# EAGLE design matrixdriver_rev1a (EAGLE 4.16)
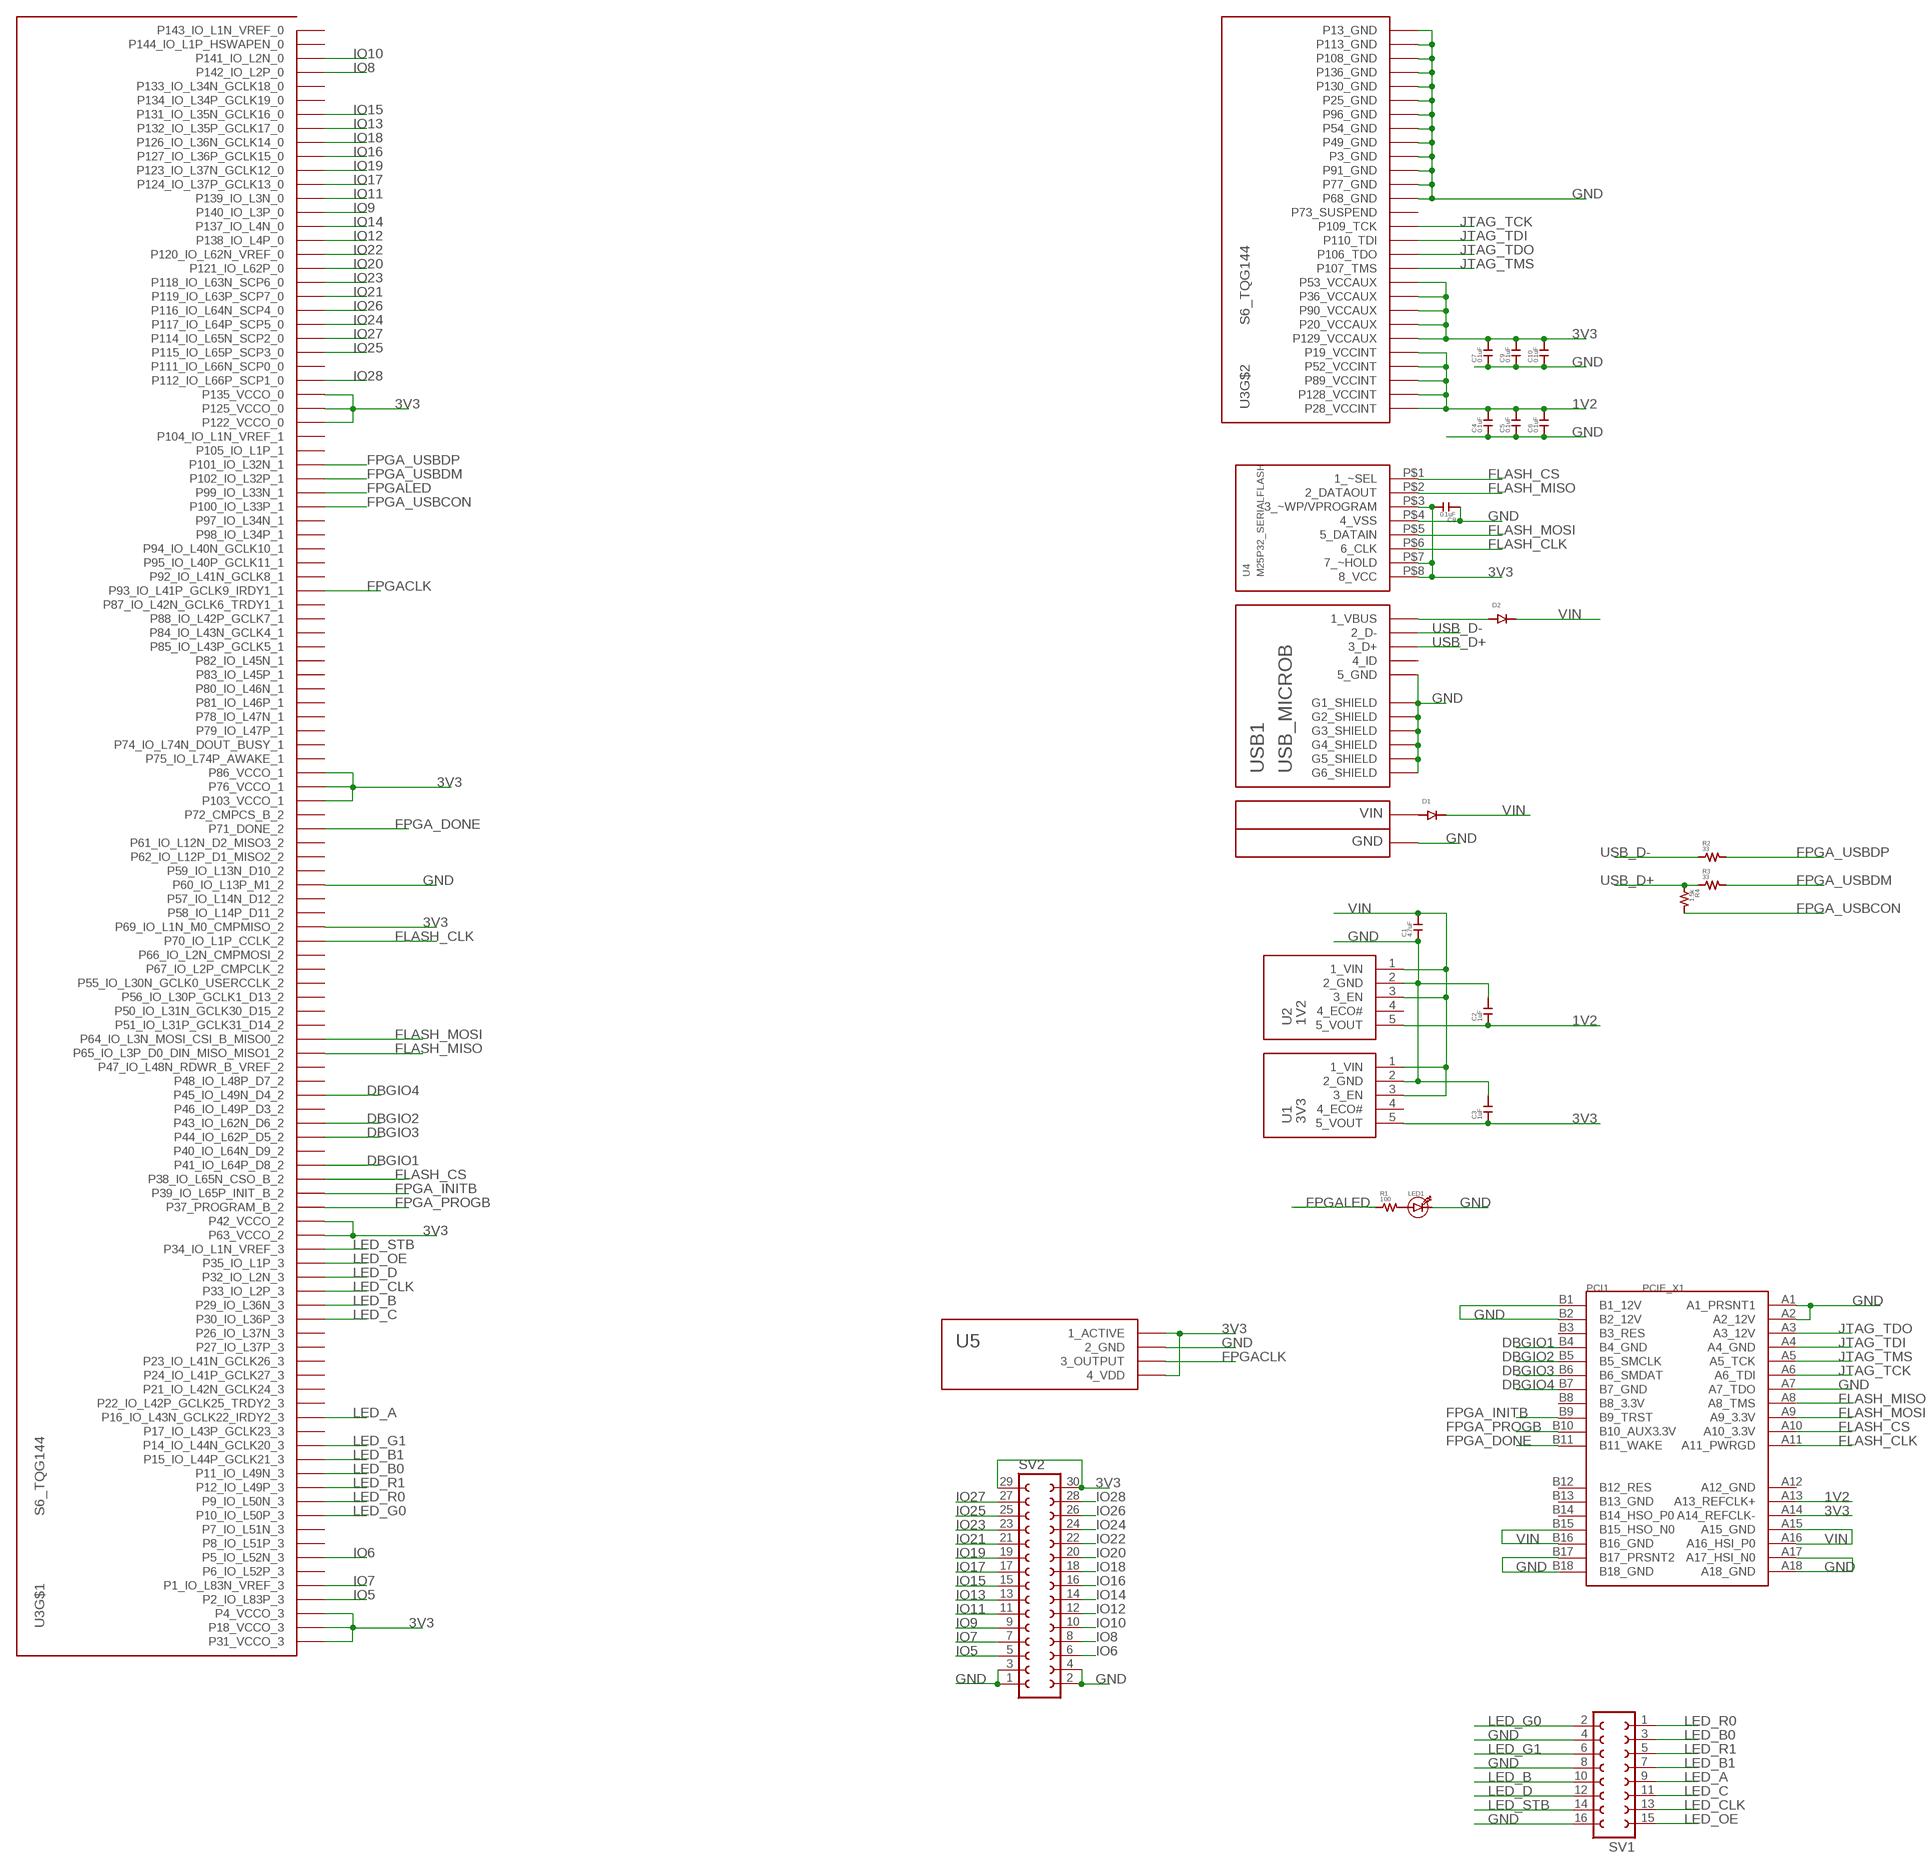
[diagram p0: schematic, sheet 1]

## Parts
C1  4.7uF  CAP0603  [0603]
C2  1uF  CAP0603  [0603]
C3  1uF  CAP0603  [0603]
C4  0.1uF  CAP0603  [0603]
C5  0.1uF  CAP0603  [0603]
C6  0.1uF  CAP0603  [0603]
C7  0.1uF  CAP0603  [0603]
C8  0.1uF  CAP0603  [0603]
C9  0.1uF  CAP0603  [0603]
C10  0.1uF  CAP0603  [0603]
D1  DIODE0603  [0603_DIODE]
D2  DIODE0603  [0603_DIODE]
GND  PIN1.2MM  [PIN_1.2MM]
LED1  LED0603  [0603_DIODE]
PCI1  PCIE_X1  [PCIE_X1]
R1  100  RES0603  [0603]
R2  33  RES0603  [0603]
R3  33  RES0603  [0603]
R4  1.5k  RES0603  [0603]
SV1  FE08-2  [FE08-2]
SV2  FE15-2  [FE15-2]
U1  3V3  VREG_LDO  [SOT-23-5]
U2  1V2  VREG_LDO  [SOT-23-5]
U3  S6_TQG144  [QFP144_.5MM_22X22]
U4  M25P32_SERIALFLASH  [SOIC-8-5.3MM]
U5  OSCASDMB  [ASDMB_2X2.5]
USB1  USB_MICROB  [USB_MICROB_FEMALE_FCI_10103594]
VIN  PIN1.2MM  [PIN_1.2MM]

## Nets
1V2: C2.1 C4.2 C5.2 C6.2 PCI1.A13(A13_REFCLK+) U2.5(5_VOUT) U3.P$19(P19_VCCINT) U3.P$28(P28_VCCINT) U3.P$52(P52_VCCINT) U3.P$89(P89_VCCINT) U3.P$128(P128_VCCINT)
3V3: C3.1 C7.2 C8.2 C9.2 C10.2 PCI1.A14(A14_REFCLK-) SV2.29 SV2.30 U1.5(5_VOUT) U3.P$4(P4_VCCO_3) U3.P$18(P18_VCCO_3) U3.P$20(P20_VCCAUX) U3.P$31(P31_VCCO_3) U3.P$36(P36_VCCAUX) U3.P$42(P42_VCCO_2) U3.P$53(P53_VCCAUX) U3.P$63(P63_VCCO_2) U3.P$69(P69_IO_L1N_M0_CMPMISO_2) U3.P$76(P76_VCCO_1) U3.P$86(P86_VCCO_1) U3.P$90(P90_VCCAUX) U3.P$103(P103_VCCO_1) U3.P$122(P122_VCCO_0) U3.P$125(P125_VCCO_0) U3.P$129(P129_VCCAUX) U3.P$135(P135_VCCO_0) U4.P$3(3_~WP/VPROGRAM) U4.P$7(7_~HOLD) U4.P$8(8_VCC) U5.1(1_ACTIVE) U5.4(4_VDD)
DBGIO1: PCI1.B4(B4_GND) U3.P$41(P41_IO_L64P_D8_2)
DBGIO2: PCI1.B5(B5_SMCLK) U3.P$43(P43_IO_L62N_D6_2)
DBGIO3: PCI1.B6(B6_SMDAT) U3.P$44(P44_IO_L62P_D5_2)
DBGIO4: PCI1.B7(B7_GND) U3.P$45(P45_IO_L49N_D4_2)
FLASH_CLK: PCI1.A11(A11_PWRGD) U3.P$70(P70_IO_L1P_CCLK_2) U4.P$6(6_CLK)
FLASH_CS: PCI1.A10(A10_3.3V) U3.P$38(P38_IO_L65N_CSO_B_2) U4.P$1(1_~SEL)
FLASH_MISO: PCI1.A8(A8_TMS) U3.P$65(P65_IO_L3P_D0_DIN_MISO_MISO1_2) U4.P$2(2_DATAOUT)
FLASH_MOSI: PCI1.A9(A9_3.3V) U3.P$64(P64_IO_L3N_MOSI_CSI_B_MISO0_2) U4.P$5(5_DATAIN)
FPGA_DONE: PCI1.B11(B11_WAKE) U3.P$71(P71_DONE_2)
FPGA_INITB: PCI1.B9(B9_TRST) U3.P$39(P39_IO_L65P_INIT_B_2)
FPGA_PROGB: PCI1.B10(B10_AUX3.3V) U3.P$37(P37_PROGRAM_B_2)
FPGA_USBCON: R4.2 U3.P$100(P100_IO_L33P_1)
FPGA_USBDM: R3.2 U3.P$102(P102_IO_L32P_1)
FPGA_USBDP: R2.2 U3.P$101(P101_IO_L32N_1)
FPGACLK: U3.P$93(P93_IO_L41P_GCLK9_IRDY1_1) U5.3(3_OUTPUT)
FPGALED: R1.1 U3.P$99(P99_IO_L33N_1)
GND: C1.1 C2.2 C3.2 C4.1 C5.1 C6.1 C7.1 C8.1 C9.1 C10.1 GND.P$1 LED1.- PCI1.A1(A1_PRSNT1) PCI1.A2(A2_12V) PCI1.A7(A7_TDO) PCI1.A17(A17_HSI_N0) PCI1.A18(A18_GND) PCI1.B1(B1_12V) PCI1.B2(B2_12V) PCI1.B17(B17_PRSNT2) PCI1.B18(B18_GND) SV1.4 SV1.8 SV1.16 SV2.1 SV2.2 SV2.3 SV2.4 U1.2(2_GND) U2.2(2_GND) U3.P$3(P3_GND) U3.P$13(P13_GND) U3.P$25(P25_GND) U3.P$49(P49_GND) U3.P$54(P54_GND) U3.P$60(P60_IO_L13P_M1_2) U3.P$68(P68_GND) U3.P$77(P77_GND) U3.P$91(P91_GND) U3.P$96(P96_GND) U3.P$108(P108_GND) U3.P$113(P113_GND) U3.P$130(P130_GND) U3.P$136(P136_GND) U4.P$4(4_VSS) U5.2(2_GND) USB1.5(5_GND) USB1.G1(G1_SHIELD) USB1.G2(G2_SHIELD) USB1.G3(G3_SHIELD) USB1.G4(G4_SHIELD) USB1.G5(G5_SHIELD) USB1.G6(G6_SHIELD)
IO5: SV2.5 U3.P$2(P2_IO_L83P_3)
IO6: SV2.6 U3.P$5(P5_IO_L52N_3)
IO7: SV2.7 U3.P$1(P1_IO_L83N_VREF_3)
IO8: SV2.8 U3.P$142(P142_IO_L2P_0)
IO9: SV2.9 U3.P$140(P140_IO_L3P_0)
IO10: SV2.10 U3.P$141(P141_IO_L2N_0)
IO11: SV2.11 U3.P$139(P139_IO_L3N_0)
IO12: SV2.12 U3.P$138(P138_IO_L4P_0)
IO13: SV2.13 U3.P$132(P132_IO_L35P_GCLK17_0)
IO14: SV2.14 U3.P$137(P137_IO_L4N_0)
IO15: SV2.15 U3.P$131(P131_IO_L35N_GCLK16_0)
IO16: SV2.16 U3.P$127(P127_IO_L36P_GCLK15_0)
IO17: SV2.17 U3.P$124(P124_IO_L37P_GCLK13_0)
IO18: SV2.18 U3.P$126(P126_IO_L36N_GCLK14_0)
IO19: SV2.19 U3.P$123(P123_IO_L37N_GCLK12_0)
IO20: SV2.20 U3.P$121(P121_IO_L62P_0)
IO21: SV2.21 U3.P$119(P119_IO_L63P_SCP7_0)
IO22: SV2.22 U3.P$120(P120_IO_L62N_VREF_0)
IO23: SV2.23 U3.P$118(P118_IO_L63N_SCP6_0)
IO24: SV2.24 U3.P$117(P117_IO_L64P_SCP5_0)
IO25: SV2.25 U3.P$115(P115_IO_L65P_SCP3_0)
IO26: SV2.26 U3.P$116(P116_IO_L64N_SCP4_0)
IO27: SV2.27 U3.P$114(P114_IO_L65N_SCP2_0)
IO28: SV2.28 U3.P$112(P112_IO_L66P_SCP1_0)
JTAG_TCK: PCI1.A6(A6_TDI) U3.P$109(P109_TCK)
JTAG_TDI: PCI1.A4(A4_GND) U3.P$110(P110_TDI)
JTAG_TDO: PCI1.A3(A3_12V) U3.P$106(P106_TDO)
JTAG_TMS: PCI1.A5(A5_TCK) U3.P$107(P107_TMS)
LED_A: SV1.9 U3.P$16(P16_IO_L43N_GCLK22_IRDY2_3)
LED_B: SV1.10 U3.P$29(P29_IO_L36N_3)
LED_B0: SV1.3 U3.P$11(P11_IO_L49N_3)
LED_B1: SV1.7 U3.P$15(P15_IO_L44P_GCLK21_3)
LED_C: SV1.11 U3.P$30(P30_IO_L36P_3)
LED_CLK: SV1.13 U3.P$33(P33_IO_L2P_3)
LED_D: SV1.12 U3.P$32(P32_IO_L2N_3)
LED_G0: SV1.2 U3.P$10(P10_IO_L50P_3)
LED_G1: SV1.6 U3.P$14(P14_IO_L44N_GCLK20_3)
LED_OE: SV1.15 U3.P$35(P35_IO_L1P_3)
LED_R0: SV1.1 U3.P$9(P9_IO_L50N_3)
LED_R1: SV1.5 U3.P$12(P12_IO_L49P_3)
LED_STB: SV1.14 U3.P$34(P34_IO_L1N_VREF_3)
N$1: D2.+ USB1.1(1_VBUS)
N$2: LED1.+ R1.2
N$3: D1.+ VIN.P$1
USB_D+: R3.1 R4.1 USB1.3(3_D+)
USB_D-: R2.1 USB1.2(2_D-)
VIN: C1.2 D1.- D2.- PCI1.A15(A15_GND) PCI1.A16(A16_HSI_P0) PCI1.B15(B15_HSO_N0) PCI1.B16(B16_GND) U1.1(1_VIN) U1.3(3_EN) U2.1(1_VIN) U2.3(3_EN)
Unconnected: PCI1.A12(A12_GND) PCI1.B3(B3_RES) PCI1.B8(B8_3.3V) PCI1.B12(B12_RES) PCI1.B13(B13_GND) PCI1.B14(B14_HSO_P0) U1.4(4_ECO#) U2.4(4_ECO#) U3.P$6(P6_IO_L52P_3) U3.P$7(P7_IO_L51N_3) U3.P$8(P8_IO_L51P_3) U3.P$17(P17_IO_L43P_GCLK23_3) U3.P$21(P21_IO_L42N_GCLK24_3) U3.P$22(P22_IO_L42P_GCLK25_TRDY2_3) U3.P$23(P23_IO_L41N_GCLK26_3) U3.P$24(P24_IO_L41P_GCLK27_3) U3.P$26(P26_IO_L37N_3) U3.P$27(P27_IO_L37P_3) U3.P$40(P40_IO_L64N_D9_2) U3.P$46(P46_IO_L49P_D3_2) U3.P$47(P47_IO_L48N_RDWR_B_VREF_2) U3.P$48(P48_IO_L48P_D7_2) U3.P$50(P50_IO_L31N_GCLK30_D15_2) U3.P$51(P51_IO_L31P_GCLK31_D14_2) U3.P$55(P55_IO_L30N_GCLK0_USERCCLK_2) U3.P$56(P56_IO_L30P_GCLK1_D13_2) U3.P$57(P57_IO_L14N_D12_2) U3.P$58(P58_IO_L14P_D11_2) U3.P$59(P59_IO_L13N_D10_2) U3.P$61(P61_IO_L12N_D2_MISO3_2) U3.P$62(P62_IO_L12P_D1_MISO2_2) U3.P$66(P66_IO_L2N_CMPMOSI_2) U3.P$67(P67_IO_L2P_CMPCLK_2) U3.P$72(P72_CMPCS_B_2) U3.P$73(P73_SUSPEND) U3.P$74(P74_IO_L74N_DOUT_BUSY_1) U3.P$75(P75_IO_L74P_AWAKE_1) U3.P$78(P78_IO_L47N_1) U3.P$79(P79_IO_L47P_1) U3.P$80(P80_IO_L46N_1) U3.P$81(P81_IO_L46P_1) U3.P$82(P82_IO_L45N_1) U3.P$83(P83_IO_L45P_1) U3.P$84(P84_IO_L43N_GCLK4_1) U3.P$85(P85_IO_L43P_GCLK5_1) U3.P$87(P87_IO_L42N_GCLK6_TRDY1_1) U3.P$88(P88_IO_L42P_GCLK7_1) U3.P$92(P92_IO_L41N_GCLK8_1) U3.P$94(P94_IO_L40N_GCLK10_1) U3.P$95(P95_IO_L40P_GCLK11_1) U3.P$97(P97_IO_L34N_1) U3.P$98(P98_IO_L34P_1) U3.P$104(P104_IO_L1N_VREF_1) U3.P$105(P105_IO_L1P_1) U3.P$111(P111_IO_L66N_SCP0_0) U3.P$133(P133_IO_L34N_GCLK18_0) U3.P$134(P134_IO_L34P_GCLK19_0) U3.P$143(P143_IO_L1N_VREF_0) U3.P$144(P144_IO_L1P_HSWAPEN_0) USB1.4(4_ID)

## Library data of the parts
C1-C10 = _sg_lib:CAP0603
D1 D2 = _sg_lib:DIODE0603
GND VIN = _sg_lib:PIN
LED1 = _sg_lib:LED0603
PCI1 = _sg_misc:PCIE_X1
R1-R4 = _sg_lib:RES0603
SV1 = con-lsta:FE08-2: FEMALE HEADER
SV2 = con-lsta:FE15-2: FEMALE HEADER
U1 U2 = _sg_lib:VREG_LDO
U3 = _sg_lib:S6_TQG144
U4 = _sg_misc:M25P32_SERIALFLASH
U5 = _sg_lib:OSC
USB1 = _sg_lib:USB_MICROB

## Board
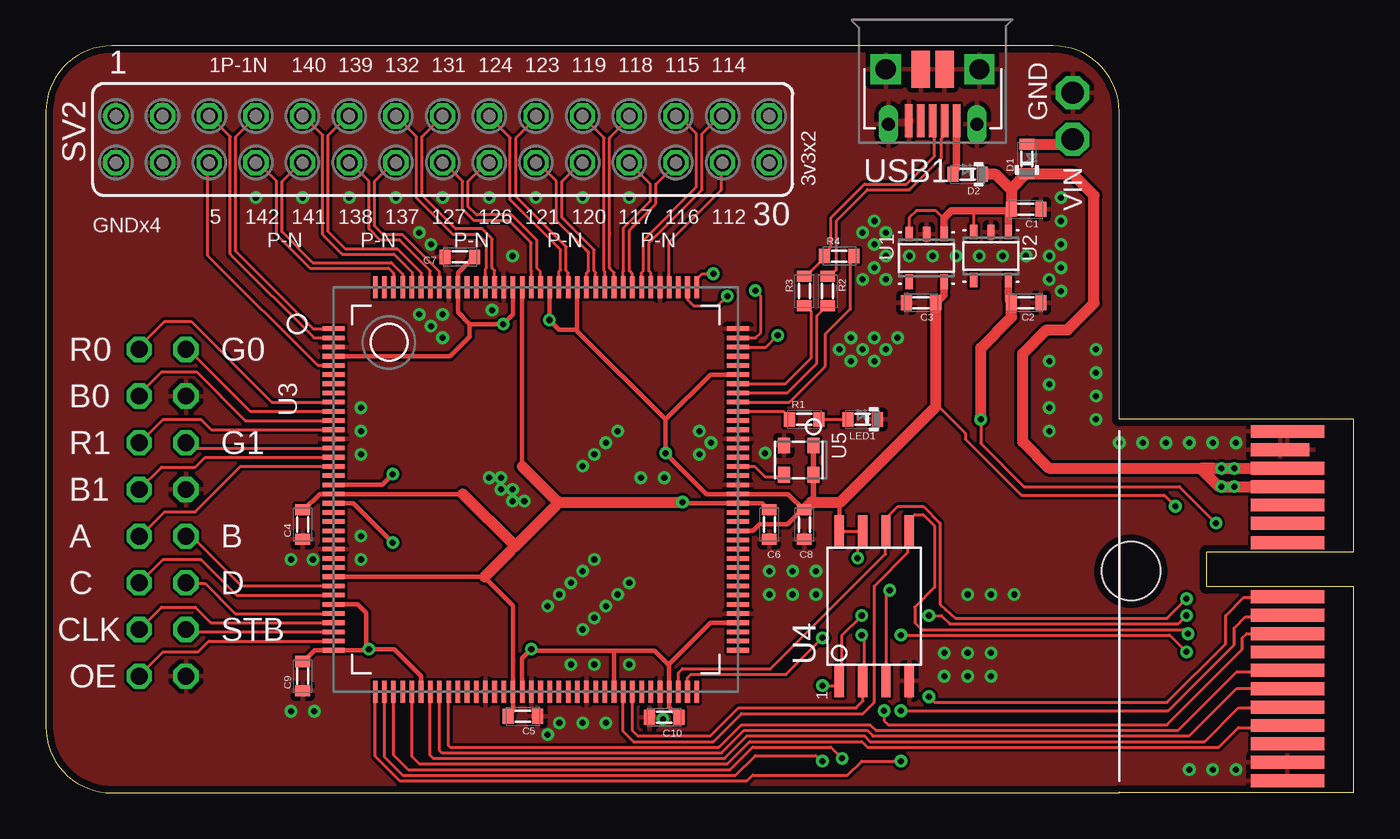
[diagram p1: board, top side]
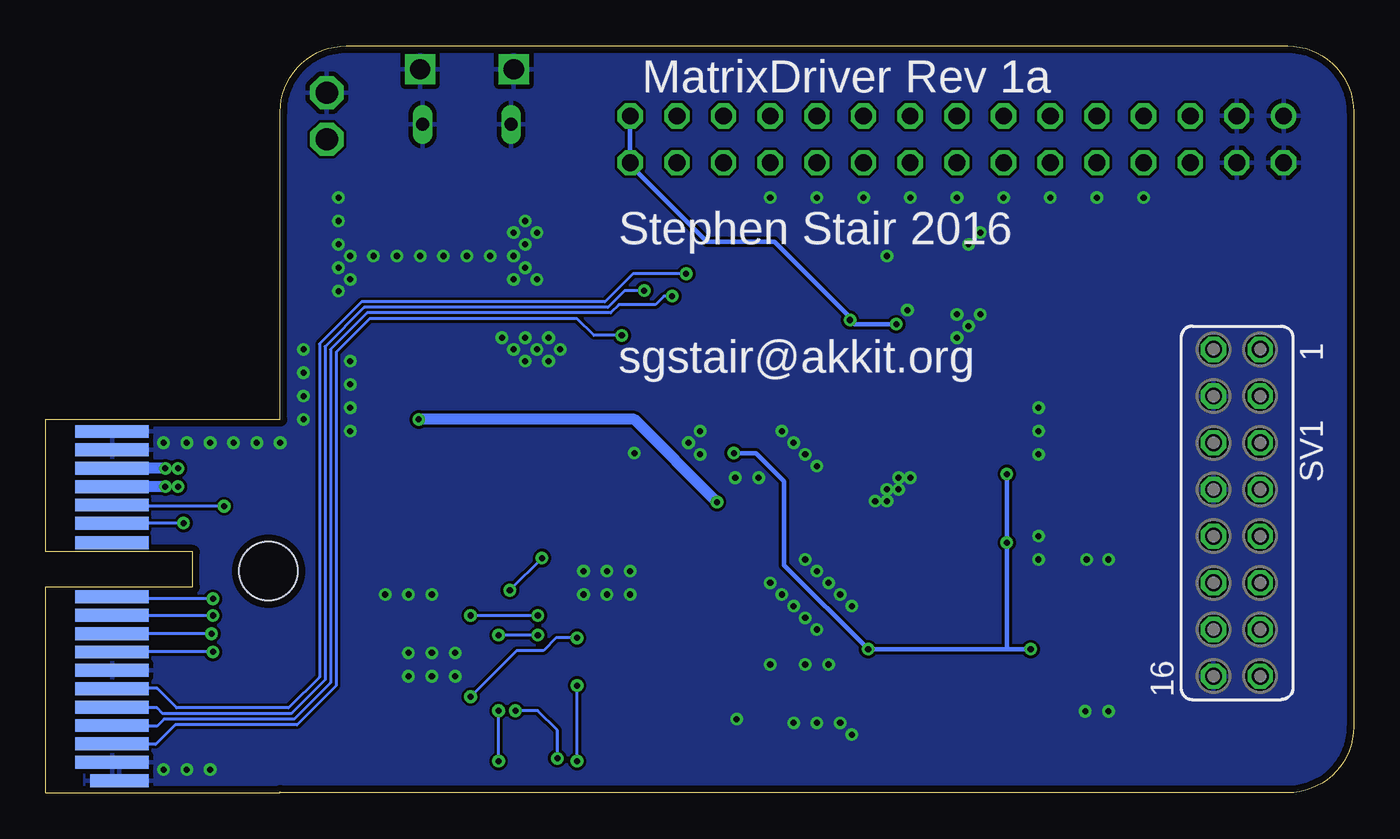
[diagram p2: board, bottom side, seen from below]

Size 71.17 x 40.64 mm. Coordinates in mm from the lower left corner, seen from the top.
Outline: 58.42,20.32 58.42,37.05 arc90 54.83,40.64 3.59,40.64 arc90 0,37.05 0,3.59 arc90 3.59,0 58.42,0 58.42,0.05
Copper layers (1*16): Top 0.0356mm / dielectric 1.5011mm / Bottom 0.0356mm
Design rules "LaenPCBOrder": minimum track width 6mil, minimum drill 13mil, track to track 6mil, track to pad 6mil, pad to pad 6mil, via to via 6mil, smd to smd 6mil, copper to edge 15mil, drill to drill 6mil, minimum pad ring 7mil, minimum via ring 7mil, stop-mask expansion 4mil, vias tented up to drill 25mil, thermal gap 10mil
Holes 3.2 mm at 59.05,12.07

### Footprints (pad centres in the part's own frame; a part is rotated, then mirrored left to right if it is on the bottom)
0603 = smd 0.6 x 0.8: 1 -0.8,0; 2 0.8,0
0603_DIODE = smd 0.6 x 0.8: + 0.8,0; - -0.8,0
PIN_1.2MM = drill 1.2 octagon: P$1 0,0
PCIE_X1 = smd 0.7 x 3.2 bottom: A1 -11.5,-8.75 | smd 0.7 x 4 bottom: A2 -10.5,-9.15; A3 -9.5,-9.15; A4 -8.5,-9.15; A5 -7.5,-9.15; A6 -6.5,-9.15; A7 -5.5,-9.15; A8 -4.5,-9.15; A9 -3.5,-9.15; A10 -2.5,-9.15; A11 -1.5,-9.15; A12 1.45,-9.15; A13 2.5,-9.15; A14 3.5,-9.15; A15 4.5,-9.15; A16 5.5,-9.15; A17 6.5,-9.15; A18 7.5,-9.15 | smd 0.7 x 4: B1 -11.5,-9.15; B2 -10.5,-9.15; B3 -9.5,-9.15; B4 -8.5,-9.15; B5 -7.5,-9.15; B6 -6.5,-9.15; B7 -5.5,-9.15; B8 -4.5,-9.15; B9 -3.5,-9.15; B10 -2.5,-9.15; B11 -1.5,-9.15; B12 1.45,-9.15; B13 2.5,-9.15; B14 3.5,-9.15; B15 4.5,-9.15; B16 5.5,-9.15; B18 7.5,-9.15 | smd 0.7 x 3.2: B17 6.5,-8.75
FE08-2 = drill 0.914 octagon: 1 -8.89,1.27; 2 -8.89,-1.27; 3 -6.35,1.27; 4 -6.35,-1.27; 5 -3.81,1.27; 6 -3.81,-1.27; 7 -1.27,1.27; 8 -1.27,-1.27; 9 1.27,1.27; 10 1.27,-1.27; 11 3.81,1.27; 12 3.81,-1.27; 13 6.35,1.27; 14 6.35,-1.27; 15 8.89,1.27; 16 8.89,-1.27
FE15-2 = drill 0.914 round: 1 -17.78,1.27 | drill 0.914 octagon: 2 -17.78,-1.27; 3 -15.24,1.27; 4 -15.24,-1.27; 5 -12.7,1.27; 6 -12.7,-1.27; 7 -10.16,1.27; 8 -10.16,-1.27; 9 -7.62,1.27; 10 -7.62,-1.27; 11 -5.08,1.27; 12 -5.08,-1.27; 13 -2.54,1.27; 14 -2.54,-1.27; 15 0,1.27; 16 0,-1.27; 17 2.54,1.27; 18 2.54,-1.27; 19 5.08,1.27; 20 5.08,-1.27; 21 7.62,1.27; 22 7.62,-1.27; 23 10.16,1.27; 24 10.16,-1.27; 25 12.7,1.27; 26 12.7,-1.27; 27 15.24,1.27; 28 15.24,-1.27; 29 17.78,1.27; 30 17.78,-1.27
SOT-23-5 = smd 0.8 x 0.4: 1 -1.3,0.95; 2 -1.3,0; 3 -1.3,-0.95; 4 1.3,-0.95; 5 1.3,0.95
QFP144_.5MM_22X22 = smd 1.2 x 0.25: P$1 -11,8.75; P$2 -11,8.25; P$3 -11,7.75; P$4 -11,7.25; P$5 -11,6.75; P$6 -11,6.25; P$7 -11,5.75; P$8 -11,5.25; P$9 -11,4.75; P$10 -11,4.25; P$11 -11,3.75; P$12 -11,3.25; P$13 -11,2.75; P$14 -11,2.25; P$15 -11,1.75; P$16 -11,1.25; P$17 -11,0.75; P$18 -11,0.25; P$19 -11,-0.25; P$20 -11,-0.75; P$21 -11,-1.25; P$22 -11,-1.75; P$23 -11,-2.25; P$24 -11,-2.75; P$25 -11,-3.25; P$26 -11,-3.75; P$27 -11,-4.25; P$28 -11,-4.75; P$29 -11,-5.25; P$30 -11,-5.75; P$31 -11,-6.25; P$32 -11,-6.75; P$33 -11,-7.25; P$34 -11,-7.75; P$35 -11,-8.25; P$36 -11,-8.75; P$73 11,-8.75; P$74 11,-8.25; P$75 11,-7.75; P$76 11,-7.25; P$77 11,-6.75; P$78 11,-6.25; P$79 11,-5.75; P$80 11,-5.25; P$81 11,-4.75; P$82 11,-4.25; P$83 11,-3.75; P$84 11,-3.25; P$85 11,-2.75; P$86 11,-2.25; P$87 11,-1.75; P$88 11,-1.25; P$89 11,-0.75; P$90 11,-0.25; P$91 11,0.25; P$92 11,0.75; P$93 11,1.25; P$94 11,1.75; P$95 11,2.25; P$96 11,2.75; P$97 11,3.25; P$98 11,3.75; P$99 11,4.25; P$100 11,4.75; P$101 11,5.25; P$102 11,5.75; P$103 11,6.25; P$104 11,6.75; P$105 11,7.25; P$106 11,7.75; P$107 11,8.25; P$108 11,8.75 | smd 0.25 x 1.2: P$37 -8.75,-11; P$38 -8.25,-11; P$39 -7.75,-11; P$40 -7.25,-11; P$41 -6.75,-11; P$42 -6.25,-11; P$43 -5.75,-11; P$44 -5.25,-11; P$45 -4.75,-11; P$46 -4.25,-11; P$47 -3.75,-11; P$48 -3.25,-11; P$49 -2.75,-11; P$50 -2.25,-11; P$51 -1.75,-11; P$52 -1.25,-11; P$53 -0.75,-11; P$54 -0.25,-11; P$55 0.25,-11; P$56 0.75,-11; P$57 1.25,-11; P$58 1.75,-11; P$59 2.25,-11; P$60 2.75,-11; P$61 3.25,-11; P$62 3.75,-11; P$63 4.25,-11; P$64 4.75,-11; P$65 5.25,-11; P$66 5.75,-11; P$67 6.25,-11; P$68 6.75,-11; P$69 7.25,-11; P$70 7.75,-11; P$71 8.25,-11; P$72 8.75,-11; P$109 8.75,11; P$110 8.25,11; P$111 7.75,11; P$112 7.25,11; P$113 6.75,11; P$114 6.25,11; P$115 5.75,11; P$116 5.25,11; P$117 4.75,11; P$118 4.25,11; P$119 3.75,11; P$120 3.25,11; P$121 2.75,11; P$122 2.25,11; P$123 1.75,11; P$124 1.25,11; P$125 0.75,11; P$126 0.25,11; P$127 -0.25,11; P$128 -0.75,11; P$129 -1.25,11; P$130 -1.75,11; P$131 -2.25,11; P$132 -2.75,11; P$133 -3.25,11; P$134 -3.75,11; P$135 -4.25,11; P$136 -4.75,11; P$137 -5.25,11; P$138 -5.75,11; P$139 -6.25,11; P$140 -6.75,11; P$141 -7.25,11; P$142 -7.75,11; P$143 -8.25,11; P$144 -8.75,11
SOIC-8-5.3MM = smd 1.778 x 0.508: P$1 -0.889,-0.635; P$2 -0.889,-1.905; P$3 -0.889,-3.175; P$4 -0.889,-4.445; P$5 7.239,-4.445; P$6 7.239,-3.175; P$7 7.239,-1.905; P$8 7.239,-0.635
ASDMB_2X2.5 = smd 0.65 x 0.85: 1 -0.8,-0.8; 2 0.8,-0.8; 3 0.8,0.8; 4 -0.8,0.8
USB_MICROB_FEMALE_FCI_10103594 = smd 0.4 x 1.8: 1 -1.3,2.8; 2 -0.65,2.8; 3 0,2.8; 4 0.65,2.8; 5 1.3,2.8 | drill 0.7 long: G1 -2.4,3; G2 2.4,3 | smd 1 x 2: G3 -0.65,0; G4 0.65,0 | drill 1.1 square: G5 -2.55,0; G6 2.55,0

### Placement (x,y rotation side)
C1  53.34,31.75 180 top
C2  53.34,26.67 0 top
C3  47.63,26.67 180 top
C4  13.97,14.61 90 top
C5  25.96,4.17 180 top
C6  39.37,14.61 90 top
C7  22.53,29.16 0 top
C8  41.27,14.61 90 top
C9  13.97,6.35 90 top
C10  33.66,4.11 0 top
D1  53.39,34.49 90 top
D2  50.16,33.66 180 top
GND  55.88,38.1 180 top
LED1  44.45,20.32 180 top
PCI1  58.42,12.17 90 top
R1  41.27,20.32 0 top
R2  42.54,27.3 270 top
R3  41.27,27.3 270 top
R4  43.18,29.21 0 top
SV1  6.35,15.24 270 bottom
SV2  21.59,35.56 0 top
U1  47.93,29.11 270 top
U2  51.43,29.21 270 top
U3  26.67,16.51 0 top
U4  42.54,6.98 90 top
U5  40.97,18.11 180 top
USB1  48.26,39.37 180 top
VIN  55.88,35.56 270 top

### Tracks (layer width: path | path; a pad name or v marks a point on that pad's centre or on a via)
1V2  (via drill 0.33)
  Top 0.152: v50.88,20.32 50.88,19.02 53.24,16.66 61.7,16.66 v63.68,14.68
  Top 0.254: C6.2 39.37,15.37 38.98,15.76 U3.P$89 34.63,15.76 34.57,15.82 | 27.94,15.82 27.86,15.82 | 25.92,17.77 U3.P$128 | U3.P$28 23.88,11.76 23.88,11.73 25.42,10.19 U3.P$52 25.42,4.46 25.12,4.17 C5.2 | 25.5,13.46 25.58,13.46 25.31,13.2 25.42,13.09 | 22.7,16.26 U3.P$19 14.89,16.26 14,15.37 C4.2
  Top 0.406: 52.55,26.65 52.54,26.66 | 52.54,26.66 C2.1 | U2.5 52.38,26.81 52.54,26.66
  Top 0.61: 52.55,26.65 52.55,25.88 50.88,24.21 v50.88,20.32 | v34.65,15.82 34.57,15.82 27.94,15.82 25.58,13.46 25.5,13.39 | 27.86,15.82 25.92,17.77 | 23.88,11.76 25.31,13.2 | 25.5,13.46 22.7,16.26
  Bottom 0.152: 67.66,14.67 67.72,14.61 | 67.66,14.67 PCI1.A13 | v63.68,14.68 67.64,14.68 67.66,14.67
  Bottom 0.61: v50.88,20.32 39.14,20.32 v34.65,15.82
3V3  (via drill 0.33)
  Top 0.152: U4.P$3 45.72,10.82 v45.92,11.02 | v44.17,12.78 44.17,13.23 44.48,13.54 44.48,14.22 U4.P$7 U4.P$8 | 48.44,21.01 48.59,21.01 50.04,19.56 50.04,19.25 53.09,16.2 60.86,16.2 v61.47,15.6
  Top 0.254: 43.18,15.82 U4.P$8 | 34.47,4.12 34.49,4.09 | 34.47,4.12 C10.2 | 34.47,4.12 33.92,4.66 U3.P$69 33.92,6.95 33.88,6.98 | C9.2 13.98,7.15 14,7.14 14.62,7.76 U3.P$36 17.44,7.76 17.5,7.82 v17.58,7.82 | U3.P$53 25.92,7.33 v26.42,7.82 26.42,7.9 26.57,7.75 30.91,7.75 | v17.58,7.82 17.5,7.75 | 33.88,6.98 33.12,7.75 30.91,7.75 | v33.73,18.49 35.96,16.26 U3.P$90 40.38,16.26 41.27,15.37 C8.2 41.16,15.41 40.36,14.61 38.84,14.61 38.49,14.26 U3.P$86 | 28.92,25.2 28.92,25.13 33.73,20.32 | 28.92,25.2 U3.P$122 | v33.73,18.49 33.73,18.41 | v33.73,18.49 33.73,20.32 | 27.42,26.04 27.42,25.72 27.94,25.2 28.92,25.2 | 27.42,26.04 U3.P$125 | U3.P$129 25.42,26.03 v24.89,25.5 24.82,25.58 24.74,25.5 23.06,25.5 | 27.42,26.04 27.41,26.04 v27.41,25.73 | 23.06,25.5 22.42,26.15 U3.P$135 22.42,28.29 23.29,29.16 C7.2 | U3.P$20 16.73,15.76 v18.87,13.61 | U3.P$42 20.42,6.35 18.95,7.82 17.73,7.82 17.65,7.9 v17.58,7.82 | U3.P$31 16.97,10.26 17.42,9.8 17.42,8.05 17.58,7.9 v17.58,7.82 | U3.P$4 22.01,23.76 23.06,24.82 23.06,25.5 | U3.P$103 36.17,22.76 33.73,20.32 | U3.P$76 36.16,9.26 33.88,6.98 | U3.P$63 30.92,7.74 30.91,7.75 | U3.P$18 18.28,16.76 v18.87,17.35
  Top 0.305: 41.81,15.82 41.81,15.75 41.77,15.79 U5.4 41.77,18.68 41.81,18.72 41.77,18.76 U5.1
  Top 0.406: C3.1 48.43,26.66 48.44,26.65 48.88,27.09 U1.5
  Top 0.61: 48.44,26.65 48.44,21.01 43.26,15.82 43.18,15.82 41.81,15.82 41.66,15.82 41.27,15.44 C8.2
  Bottom 0.152: v44.17,12.78 v45.92,11.02 | PCI1.A14 67.49,15.6 v61.47,15.6
  Bottom 0.254: v17.58,7.82 18.8,7.82 | 18.8,7.82 v26.42,7.82 30.99,12.4 30.99,16.97 32.51,18.49 v33.73,18.49 | v24.89,25.5 27.18,25.5 v27.41,25.73 27.33,25.81 31.52,30 35.18,30 39.37,34.19 SV2.30 SV2.29 | 18.8,7.82 18.87,7.9 v18.87,13.61 18.8,13.61 18.87,13.69 v18.87,17.35
DBGIO1
  Top 0.152: U3.P$41 19.92,1.98 20.32,1.58 37.08,1.58 38.3,2.79 44.4,2.79 44.7,2.49 63.83,2.49 64.9,3.56 67.03,3.56 67.26,3.79 67.38,3.67 PCI1.B4
DBGIO2
  Top 0.152: U3.P$43 20.92,2.04 21.08,1.88 36.93,1.88 38.15,3.1 44.55,3.1 44.86,2.79 63.07,2.79 64.9,4.62 67.49,4.62 67.53,4.67 PCI1.B5
DBGIO3
  Top 0.152: U3.P$44 21.42,2.3 21.54,2.18 36.78,2.18 38,3.4 44.7,3.4 45.01,3.1 62.23,3.1 64.82,5.69 67.26,5.69 67.28,5.67 PCI1.B6
DBGIO4
  Top 0.152: U3.P$45 21.92,2.57 22,2.49 36.63,2.49 37.85,3.71 44.86,3.71 45.16,3.4 61.62,3.4 64.82,6.6 67.72,6.6 67.65,6.67 PCI1.B7
FLASH_CLK  (via drill 0.33)
  Top 0.152: U3.P$70 34.42,6.53 34.65,6.76 39.45,6.76 45.7,13.01 45.7,14.07 45.77,14.15 45.72,14.2 U4.P$6 45.72,14.94 46.38,15.6 47.75,15.6 48.67,14.68 48.67,10.26 48.97,9.96 49.51,9.5 61.01,9.5 v62.08,10.57
  Bottom 0.152: PCI1.A11 67.44,10.67 67.34,10.57 v62.08,10.57
FLASH_CS  (via drill 0.33)
  Top 0.152: U3.P$38 18.42,1.95 19.41,0.96 37.54,0.96 38.61,2.03 41.88,2.03 v42.27,1.73 | 43.33,5.84 43.18,5.99 U4.P$1 | v42.27,5.84 43.33,5.84 | 43.33,5.84 43.33,8.59 v44.4,9.65 | v48.06,9.65 48.74,9.65 49.2,9.2 61.62,9.2 v62.08,9.65
  Bottom 0.152: v42.27,1.73 v42.27,5.84 | v44.4,9.65 v48.06,9.65 | PCI1.A10 67.27,9.67 67.26,9.65 v62.08,9.65
FLASH_MISO  (via drill 0.33)
  Top 0.152: U3.P$65 31.92,3.39 32.21,3.1 36.17,3.1 37.69,4.62 44.09,4.62 44.48,5 44.48,5.92 44.55,5.99 | 44.55,5.99 U4.P$2 | 44.55,5.99 44.55,8.43 v44.4,8.59 | v46.53,8.59 61.16,8.59 v62.08,7.67
  Bottom 0.152: v44.4,8.59 v46.53,8.59 | PCI1.A8 67.34,7.67 v62.08,7.67
FLASH_MOSI  (via drill 0.33)
  Top 0.152: U3.P$64 31.42,3.35 31.98,2.79 36.32,2.79 37.85,4.32 44.48,4.32 45.09,4.93 45.09,11.25 46.91,13.08 46.91,14.15 U4.P$5 46.99,14.83 47.29,15.14 47.75,15.14 48.36,14.53 48.36,11.18 47.29,10.11 47.29,9.27 47.68,8.89 61.93,8.89 v62.15,8.66
  Bottom 0.152: PCI1.A9 v62.15,8.66
FPGA_DONE  (via drill 0.33)
  Top 0.152: U3.P$71 34.92,6.27 35.1,6.45 40.28,6.45 v42.27,8.43 | v48.06,5.23 48.36,4.93 61.01,4.93 64.21,8.13 64.21,9.65 65.2,10.64 67.34,10.64 67.41,10.57 67.51,10.67 PCI1.B11
  Bottom 0.152: v42.27,8.43 43.41,8.43 44.09,7.75 45.54,7.75 v48.06,5.23
FPGA_INITB  (via drill 0.33)
  Top 0.152: U3.P$39 18.92,2.06 19.71,1.27 37.24,1.27 38.46,2.49 42.72,2.49 v43.33,1.88 | v45.62,4.47 45.62,3.94 45.85,3.71 61.01,3.71 65.13,7.82 65.13,8.43 65.35,8.66 67.49,8.66 67.49,8.67 PCI1.B9
  Bottom 0.152: v43.33,1.88 43.33,3.4 44.4,4.47 v45.62,4.47
FPGA_PROGB  (via drill 0.33)
  Top 0.152: U3.P$37 17.92,1.99 19.25,0.66 38.15,0.66 38.46,0.96 43.64,0.96 44.4,1.73 v46.53,1.73 | 67.66,9.67 67.72,9.73 | 67.66,9.67 PCI1.B10 67.63,9.67 67.64,9.65 | 67.64,9.65 67.66,9.67 | v46.53,4.47 61.09,4.47 64.67,8.05 64.67,8.97 65.28,9.58 66.88,9.58 67.03,9.73 67.56,9.73 67.64,9.65
  Bottom 0.152: v46.53,1.73 v46.53,4.47
FPGA_USBCON
  Top 0.152: U3.P$100 40.46,21.26 42.42,23.22 42.42,24.97 43.79,26.34 43.79,29.01 43.98,29.2 R4.2
FPGA_USBDM
  Top 0.152: U3.P$102 40.24,22.26 41.66,23.67 41.66,26.19 41.34,26.51 R3.2
FPGA_USBDP
  Top 0.152: U3.P$101 40.35,21.76 41.96,23.37 41.96,25.96 42.51,26.51 R2.2
FPGACLK
  Top 0.152: U3.P$93 38.58,17.76 39.14,17.2 40.06,17.2 40.13,17.12 U5.3
FPGALED
  Top 0.152: R1.1 40.48,20.36 40.51,20.4 40.15,20.76 U3.P$99
GND  (via drill 0.33)
  other vias: 64.77,1.27 63.5,1.27 62.23,1.27 57.15,24.13 57.15,22.86 57.15,21.59 57.15,20.32 54.61,23.5 54.61,22.23 54.61,20.95 54.61,19.69 44.45,27.94 45.09,28.58 45.72,27.94 45.72,29.21 45.09,29.84 45.72,30.48 45.09,31.12 44.45,30.48 45.09,24.77 44.45,24.13 43.82,24.77 43.18,24.13 43.82,23.5 45.09,23.5 45.72,24.13 46.35,24.77 46.99,29.21 48.26,29.21 49.53,29.21 50.8,29.21 52.07,29.21 53.34,29.21 54.61,29.21 55.24,29.84 55.24,31.12 55.24,32.38 55.24,28.58 55.24,27.3 54.61,27.94 28.58,6.98 29.84,6.98 31.75,6.98 27.94,3.81 29.21,3.81 30.48,3.81 33.58,4.01 27.3,3.18 13.34,4.45 14.61,4.45 13.34,12.7 14.53,12.7 17.15,18.41 17.15,19.69 17.15,20.95 64.77,19.05 63.5,19.05 62.23,19.05 60.96,19.05 59.69,19.05 58.42,19.05 48.9,7.62 48.9,6.35 50.16,6.35 50.16,7.62 51.43,7.62 51.43,6.35 50.16,10.8 51.43,10.8 52.71,10.8 39.37,12.07 39.37,10.8 40.64,12.07 40.64,10.8 41.91,12.07 41.91,10.8 27.3,10.16 27.94,10.8 28.58,11.43 29.21,12.07 29.84,12.7 29.21,8.89 29.84,9.52 30.48,10.16 31.12,10.8 31.75,11.43 26.04,15.88 25.4,15.88 25.4,16.51 24.77,16.51 24.77,17.15 24.13,17.15 33.66,17.15 32.38,17.15 31.12,19.69 30.48,19.05 29.84,18.41 29.21,17.78 21.59,26.04 20.32,26.04 20.95,25.4 21.59,24.77 19.05,32.38 21.59,32.38 16.51,32.38 24.13,32.38 26.67,32.38 29.21,32.38 31.75,32.38 13.97,32.38 11.43,32.38 17.15,12.7 17.15,13.97 20.95,29.84 20.32,30.48 24.28,26.26 25.4,29.21 39.14,18.49 35.56,18.41 36.2,19.05 35.56,19.69
  pour Bottom: -0.1,49.73 69.09,49.73 69.09,-4.06 -7.49,-4.06 -7.49,40.51
  pour Top: -0.25,48.06 69.01,47.98 69.01,-3.3 -5.36,-3.23 -5.36,39.98
IO5
  Top 0.152: U3.P$2 14.59,24.76 10.03,29.31 10.03,35.71 8.91,36.83 SV2.5
IO6
  Top 0.152: U3.P$5 14.79,23.26 8.81,29.23 8.81,34.27 8.79,34.29 | 8.79,34.29 8.74,34.34 | 8.79,34.29 SV2.6
IO7
  Top 0.152: U3.P$1 14.54,25.26 10.34,29.46 10.34,35.71 11.43,36.8 SV2.7
IO8
  Top 0.152: U3.P$142 18.92,28.27 18.64,28.55 14.38,28.55 12.55,30.38 12.55,33.27 11.48,34.34 SV2.8
IO9
  Top 0.152: U3.P$140 19.92,28.34 18.95,29.31 16.13,29.31 15.06,30.38 15.06,35.79 14,36.86 SV2.9
IO10
  Top 0.152: U3.P$141 19.42,28.23 18.8,28.85 14.53,28.85 12.85,30.53 12.85,33.27 13.97,34.39 | 13.97,34.39 14,34.42 | 13.97,34.39 SV2.10
IO11
  Top 0.152: U3.P$139 20.42,28.3 19.1,29.62 16.28,29.62 15.37,30.53 15.37,35.79 16.43,36.86 16.46,36.83 SV2.11
IO12
  Top 0.152: U3.P$138 20.92,28.41 19.25,30.07 18.19,30.07 17.58,30.68 17.58,33.27 16.56,34.29 SV2.12
IO13
  Top 0.152: U3.P$132 23.92,28.49 23.98,28.55 23.98,29.92 23.52,30.38 22.15,30.38 20.17,32.36 20.17,35.71 SV2.13
IO14
  Top 0.152: U3.P$137 21.42,28.36 19.41,30.38 18.34,30.38 17.88,30.84 17.88,33.27 18.95,34.34 19,34.29 SV2.14
IO15
  Top 0.152: U3.P$131 24.42,28.41 24.28,28.55 24.28,30.15 23.75,30.68 22.3,30.68 20.47,32.51 20.47,35.71 SV2.15 21.62,36.86
IO16
  Top 0.152: SV2.16 21.59,34.32 21.62,34.34 22.68,33.27 22.68,31.75 23.29,31.14 25.2,31.14 26.42,29.92 26.42,28.4 26.42,28.39 U3.P$127
IO17
  Top 0.152: 27.86,29.69 25.27,32.28 25.27,35.64 24.13,36.78 SV2.17 | 27.86,29.69 27.92,29.64 | U3.P$124 27.92,28.38 28.02,28.47 28.02,29.54 27.86,29.69
IO18
  Top 0.152: U3.P$126 26.92,28.35 26.72,28.55 26.72,30.07 25.35,31.45 23.44,31.45 22.99,31.9 22.99,33.27 24.05,34.34 24.11,34.29 SV2.18
IO19
  Top 0.152: SV2.19 26.67,36.68 26.65,36.7 25.58,35.64 25.58,32.44 28.28,29.73 28.32,29.69 28.32,28.4 28.42,28.3 U3.P$123
IO20
  Top 0.152: 29.39,29.54 27.79,31.14 27.79,33.27 26.77,34.29 SV2.20 | 29.39,29.54 29.42,29.51 | U3.P$121 29.42,28.28 29.54,28.4 29.54,29.39 29.39,29.54
IO21
  Top 0.152: SV2.21 29.21,36.8 30.38,35.64 30.38,28.4 30.42,28.36 U3.P$119
IO22
  Top 0.152: SV2.22 29.11,34.29 28.09,33.27 28.09,31.29 29.84,29.54 29.84,28.4 29.92,28.32 U3.P$120
IO23
  Top 0.152: 31.8,36.75 31.83,36.86 | 31.8,36.75 SV2.23 | 30.68,30.45 30.68,30.38 | 30.68,30.45 30.68,35.64 31.8,36.75 | U3.P$118 30.92,28.31 30.68,28.55 30.68,30.45
IO24
  Top 0.152: SV2.24 31.75,34.27 32.89,33.12 32.89,32.21 31.45,30.76 31.45,28.4 31.42,28.37 U3.P$117
IO25
  Top 0.152: SV2.25 34.29,36.88 34.34,36.93 35.41,35.87 35.41,32.97 32.51,30.07 32.51,28.4 32.42,28.3 U3.P$115
IO26
  Top 0.152: 31.98,30.84 31.92,30.78 | 31.98,30.84 33.2,32.05 33.2,33.12 34.34,34.27 34.32,34.29 SV2.26 | U3.P$116 31.92,28.23 31.75,28.4 31.75,30.61 31.98,30.84
IO27
  Top 0.152: 32.97,30.07 32.92,30.02 | 32.97,30.07 35.71,32.82 35.71,35.87 36.7,36.86 36.73,36.83 SV2.27 | U3.P$114 32.92,28.29 32.82,28.4 32.82,29.92 32.97,30.07
IO28
  Top 0.152: U3.P$112 33.92,29.96 36.78,32.82 36.78,34.27 36.83,34.32 | 36.83,34.32 36.86,34.34 | 36.83,34.32 SV2.28
JTAG_TCK  (via drill 0.33)
  Top 0.152: U3.P$109 35.42,27.95 35.71,28.25 v36.32,28.25
  Bottom 0.152: v36.32,28.25 39.22,28.25 40.74,26.72 54,26.72 56.29,24.44 56.29,6.3 57.96,4.62 64.06,4.62 65.13,5.69 67.49,5.69 67.56,5.61 67.57,5.62 PCI1.A6
JTAG_TDI  (via drill 0.33)
  Top 0.152: U3.P$110 34.92,26.83 35.26,26.49 36.55,26.49 v37.08,27.03
  Bottom 0.152: v37.08,27.03 37.54,27.03 38,26.57 39.98,26.57 40.44,26.11 53.7,26.11 55.68,24.13 55.68,5.99 57.66,4.01 64.75,4.01 65.13,3.63 67.72,3.63 67.68,3.67 PCI1.A4
JTAG_TDO  (via drill 0.33)
  Top 0.152: U3.P$106 39.2,24.26 v39.83,24.89
  Bottom 0.152: v39.83,24.89 41.35,24.89 42.27,25.81 53.54,25.81 55.37,23.98 55.37,5.84 57.51,3.71 64.13,3.71 65.2,2.64 67.49,2.64 67.56,2.57 67.57,2.57 PCI1.A3
JTAG_TMS  (via drill 0.33)
  Top 0.152: U3.P$107 38.63,24.76 38.91,25.04 38.91,27.03 v38.61,27.33
  Bottom 0.152: v38.61,27.33 39.68,27.33 40.59,26.42 53.85,26.42 55.98,24.28 55.98,6.15 57.81,4.32 64.82,4.32 65.13,4.62 67.49,4.62 67.53,4.67 PCI1.A5
LED_A
  Top 0.152: U3.P$16 10.6,17.76 8.13,15.29 6.45,15.29 5.08,13.92 SV1.9
LED_B
  Top 0.152: SV1.10 7.87,13.97 7.9,14 10.63,11.26 U3.P$29
LED_B0
  Top 0.152: U3.P$11 10.86,20.26 8.2,22.91 6.3,22.91 5.08,21.69 SV1.3
LED_B1
  Top 0.152: U3.P$15 8.66,18.26 8.13,17.73 6.3,17.73 SV1.7
LED_C
  Top 0.152: U3.P$30 10.37,10.76 8.43,12.7 6.38,12.7 5.11,11.43 SV1.11
LED_CLK
  Top 0.152: U3.P$33 8.98,9.26 8.13,10.11 6.3,10.11 SV1.13
LED_D
  Top 0.152: U3.P$32 10.31,9.76 8.66,11.41 7.59,11.41 SV1.12
LED_G0
  Top 0.152: SV1.2 7.75,24.13 11.12,20.76 U3.P$10
LED_G1
  Top 0.152: SV1.6 7.59,19.02 7.86,18.76 U3.P$14
LED_OE
  Top 0.152: U3.P$35 8.87,8.26 8.28,7.67 6.38,7.67 5.08,6.38 SV1.15
LED_R0
  Top 0.152: U3.P$9 12.29,21.26 7.9,25.65 6.45,25.65 5,24.21 SV1.1
LED_R1
  Top 0.152: U3.P$12 8.99,19.76 8.43,20.32 6.38,20.32 5.08,19.02 SV1.5
LED_STB
  Top 0.152: SV1.14 7.67,8.89 7.8,8.76 U3.P$34
N$1
  Top 0.406: D2.+ 49.37,33.72 49.35,33.73 49.56,33.94 USB1.1
N$2
  Top 0.152: 43.65,20.33 43.71,20.4 | 43.65,20.33 LED1.+ | R1.2 43.64,20.32 43.65,20.33
N$3
  Top 0.406: VIN.P$1 55.88,35.38
  Top 0.61: VIN.P$1 55.83,35.56 55.56,35.29 D1.+
USB_D+
  Top 0.152: 41.58,28.11 R3.1 41.36,28.11 42.27,29.01 42.27,29.23 | USB1.3 48.26,36.5 48.36,36.4 48.36,34.65 46.84,33.12 44.55,33.12 42.72,31.29 42.72,29.69 42.27,29.23 | 42.27,29.23 42.29,29.21 R4.1
USB_D-
  Top 0.152: 48.91,36.64 48.97,36.7 | 48.91,36.64 USB1.2 | 48.91,36.64 48.9,36.63 48.9,35.87 48.74,35.56 48.74,34.57 46.99,32.82 44.7,32.82 43.03,31.14 43.03,28.47 42.72,28.17 | 42.54,27.99 42.49,27.94 | 42.54,27.99 R2.1 42.66,28.11 42.72,28.17 | 42.54,27.99 42.72,28.17
VIN  (via drill 0.33)
  Top 0.152: U2.3 50.49,31.59 50.57,31.67 | U1.3 46.98,31.28 47.37,31.67 48.44,31.67 48.83,31.28 48.88,31.28
  Top 0.406: U2.1 52.38,31.73 52.4,31.75 | 52.4,31.75 C1.2 52.48,31.75 52.4,31.67 50.57,31.67 49.28,31.67 48.88,31.28 U1.1 | 52.54,31.89 52.4,31.75
  Top 0.61: 52.54,32.82 52.54,31.89 | 52.54,32.82 52.54,32.88 53.32,33.66 | 52.54,32.82 52.55,32.82 51.71,33.66 D2.- | 63.3,17.67 54.6,17.67 53.16,19.1 53.16,23.9 54.46,25.2 55.6,25.2 57.05,26.65 57.05,32.51 55.91,33.66 53.32,33.66 | 63.3,17.67 63.52,17.67 | 63.52,17.67 PCI1.A16 | 53.32,33.66 53.35,33.69 D1.- | 63.52,17.67 62.84,17.65 63.83,16.67 | 63.83,16.67 PCI1.A15 | 63.83,16.67 v64.66,16.67 v64.67,16.66 | 63.52,17.67 64.66,17.67 v64.67,17.65 | 63.3,17.67 63.3,17.65 v63.98,17.65 | v63.98,16.66 63.83,16.66 63.83,16.67
  Bottom 0.61: PCI1.A16 67.57,17.66 67.56,17.65 v64.67,17.65 | PCI1.A15 v64.67,16.66

### Text on the board
tPlace: 1P-1N | 140 | 139 | 132 | 131 | 124 | 123 | 119 | 118 | 115 | 114 | 3v3x2 | 5 | 142 | 141 | 138 | 137 | 127 | 126 | 121 | 120 | 117 | 116 | 112 | GNDx4 | P-N | P-N | P-N | P-N | P-N | R0 | G0 | B0 | R1 | G1 | B1 | A | B | C | D | CLK | STB | OE
bPlace: MatrixDriver Rev 1a | Stephen Stair 2016 | sgstair@akkit.org